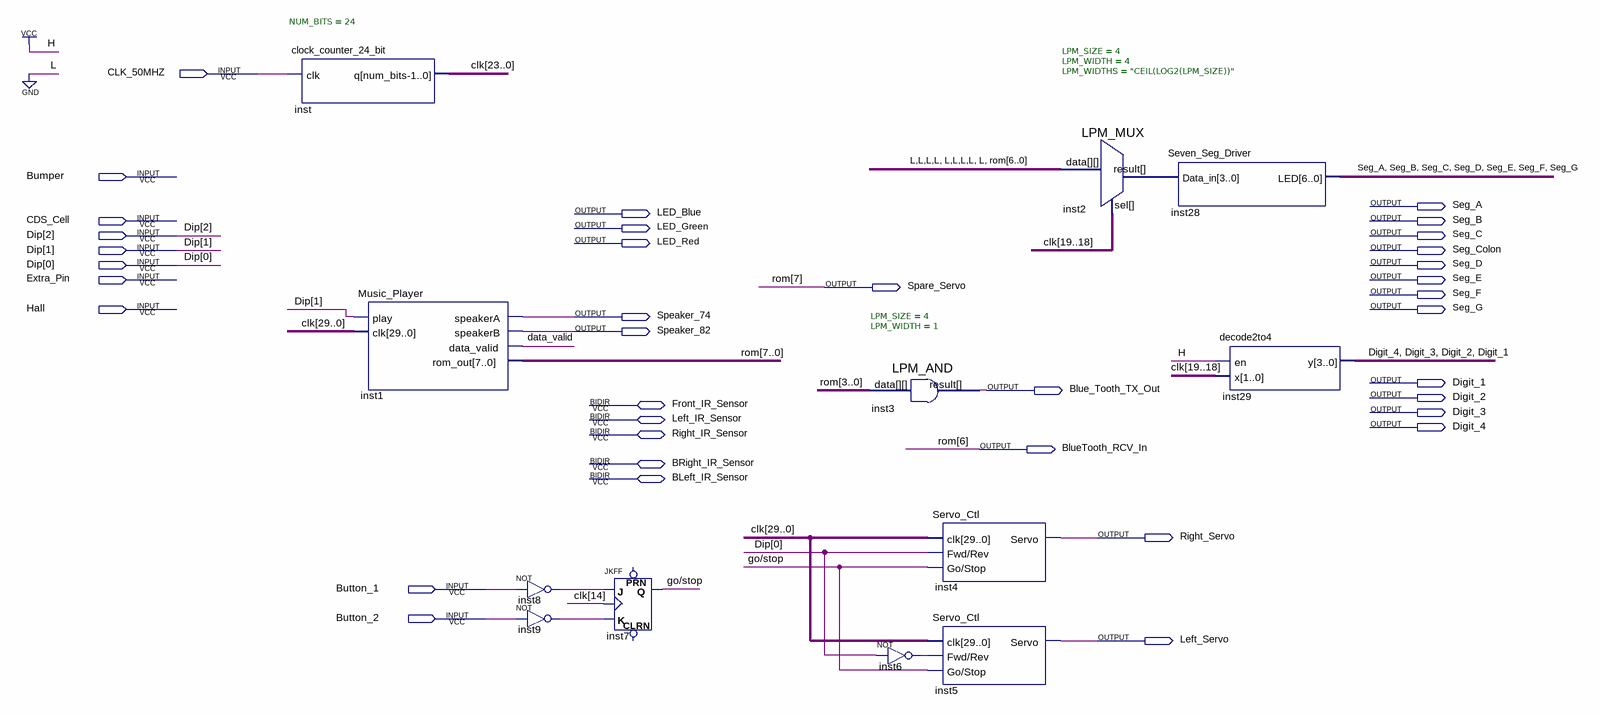
[diagram p0: schematic sheet]
// Quartus schematic sellicott_Robot.bdf as structural Verilog: 12 symbols, 37 pins
module sellicott_Robot (
  input  CLK_50MHZ,
  input  Bumper,
  input  CDS_Cell,
  input  [2:0] Dip,
  input  Extra_Pin,
  input  Hall,
  input  Button_1,
  input  Button_2,
  inout  Front_IR_Sensor,
  inout  Left_IR_Sensor,
  inout  Right_IR_Sensor,
  inout  BRight_IR_Sensor,
  inout  BLeft_IR_Sensor,
  output Seg_A,
  output LED_Blue,
  output Seg_B,
  output LED_Green,
  output Seg_C,
  output LED_Red,
  output Seg_Colon,
  output Seg_D,
  output Seg_E,
  output Spare_Servo,
  output Seg_F,
  output Seg_G,
  output Speaker_74,
  output Speaker_82,
  output Digit_1,
  output Blue_Tooth_TX_Out,
  output Digit_2,
  output Digit_3,
  output Digit_4,
  output BlueTooth_RCV_In,
  output Right_Servo,
  output Left_Servo
);

  wire data_valid, \go/stop , inst6_out, inst8_out, inst9_out;
  wire [3:0] inst2_result;
  wire [5:0] rom;
  wire [29:0] clk;

  clock_counter_24_bit #(.NUM_BITS(24)) inst (.clk(CLK_50MHZ), .q(clk[23:0]));
  Music_Player inst1 (
    .play(Dip[1]), .clk(clk), .speakerA(Speaker_74), .speakerB(Speaker_82), .data_valid(data_valid),
    .rom_out({Spare_Servo, BlueTooth_RCV_In, rom}));
  not inst8 (inst8_out, Button_1);
  not inst9 (inst9_out, Button_2);
  JKFF inst7 (.K(inst9_out), .J(inst8_out), .CLK(clk[14]), .Q(\go/stop ));  // open: PRN, CLRN
  LPM_AND #(.LPM_SIZE(4), .LPM_WIDTH(1)) inst3 (.data(rom[3:0]), .result(Blue_Tooth_TX_Out));
  not inst6 (inst6_out, Dip[0]);
  Servo_Ctl inst4 (.clk(clk), .\Fwd/Rev (Dip[0]), .\Go/Stop (\go/stop ), .Servo(Right_Servo));
  Servo_Ctl inst5 (.clk(clk), .\Fwd/Rev (inst6_out), .\Go/Stop (\go/stop ), .Servo(Left_Servo));
  LPM_MUX #(.LPM_SIZE(4), .LPM_WIDTH(4), .LPM_WIDTHS("CEIL(LOG2(LPM_SIZE))")) inst2 (
    .data({{9{1'b0}}, BlueTooth_RCV_In, rom}), .sel(clk[19:18]), .result(inst2_result));
  Seven_Seg_Driver inst28 (.Data_in(inst2_result), .LED({Seg_A, Seg_B, Seg_C, Seg_D, Seg_E, Seg_F, Seg_G}));
  decode2to4 inst29 (.en(1'b1), .x(clk[19:18]), .y({Digit_4, Digit_3, Digit_2, Digit_1}));

  // Other names for the same wires on the sheet: rom[7:6] = {Spare_Servo, BlueTooth_RCV_In}
endmodule
